# EAGLE schematic TC4Server Test (EAGLE 6.4)
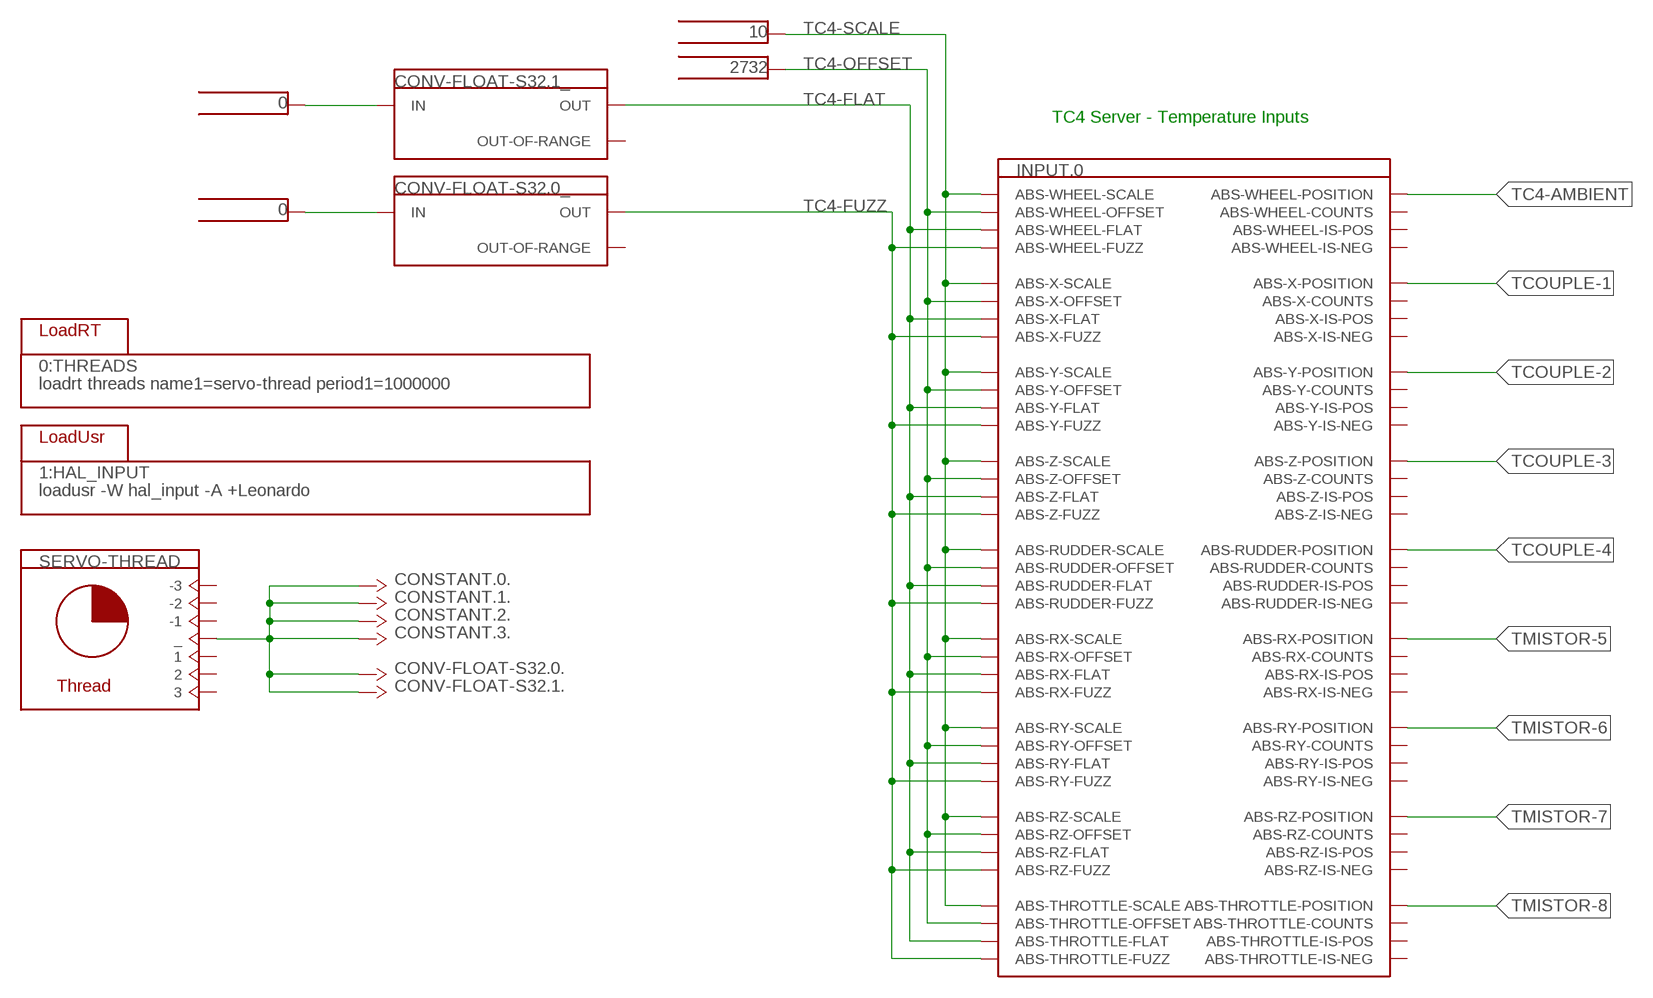
[diagram p0: schematic, sheet 1]

## Parts
0:THREADS  loadrt threads name1=servo-thread period1=1000000  LOADRT  [DUMMY]
CONSTANT.0  10  CONSTANT  [DUMMY]
CONSTANT.1  2732  CONSTANT  [DUMMY]
CONSTANT.2  0  CONSTANT  [DUMMY]
CONSTANT.3  0  CONSTANT  [DUMMY]
CONV-FLOAT-S32.0  CONV_FLOAT_S32  [DUMMY]
CONV-FLOAT-S32.1  CONV_FLOAT_S32  [DUMMY]
INPUT.0  JOYSTICK  [DUMMY]
SERVO-THREAD  THREAD  [DUMMY]

## Nets
N$1: CONSTANT.0.P$1 CONSTANT.1.P$1 CONSTANT.2.P$1 CONSTANT.3.P$1 CONV-FLOAT-S32.0.P$1(.:PIN_THREAD) CONV-FLOAT-S32.1.P$1(.:PIN_THREAD) SERVO-THREAD.P$7(_)
N$2: CONSTANT.2.P$2 CONV-FLOAT-S32.1.P$3(_:IN)
N$3: CONSTANT.3.P$2 CONV-FLOAT-S32.0.P$3(_:IN)
TC4-AMBIENT: INPUT.0.P$47(ABS-WHEEL-POSITION)
TC4-FLAT: CONV-FLOAT-S32.1.P$4(_:OUT) INPUT.0.P$2(ABS-RUDDER-FLAT) INPUT.0.P$10(ABS-RX-FLAT) INPUT.0.P$18(ABS-RY-FLAT) INPUT.0.P$26(ABS-RZ-FLAT) INPUT.0.P$34(ABS-THROTTLE-FLAT) INPUT.0.P$42(ABS-WHEEL-FLAT) INPUT.0.P$50(ABS-X-FLAT) INPUT.0.P$58(ABS-Y-FLAT) INPUT.0.P$66(ABS-Z-FLAT)
TC4-FUZZ: CONV-FLOAT-S32.0.P$4(_:OUT) INPUT.0.P$3(ABS-RUDDER-FUZZ) INPUT.0.P$11(ABS-RX-FUZZ) INPUT.0.P$19(ABS-RY-FUZZ) INPUT.0.P$27(ABS-RZ-FUZZ) INPUT.0.P$35(ABS-THROTTLE-FUZZ) INPUT.0.P$43(ABS-WHEEL-FUZZ) INPUT.0.P$51(ABS-X-FUZZ) INPUT.0.P$59(ABS-Y-FUZZ) INPUT.0.P$67(ABS-Z-FUZZ)
TC4-OFFSET: CONSTANT.1.P$2 INPUT.0.P$6(ABS-RUDDER-OFFSET) INPUT.0.P$14(ABS-RX-OFFSET) INPUT.0.P$22(ABS-RY-OFFSET) INPUT.0.P$30(ABS-RZ-OFFSET) INPUT.0.P$38(ABS-THROTTLE-OFFSET) INPUT.0.P$46(ABS-WHEEL-OFFSET) INPUT.0.P$54(ABS-X-OFFSET) INPUT.0.P$62(ABS-Y-OFFSET) INPUT.0.P$70(ABS-Z-OFFSET)
TC4-SCALE: CONSTANT.0.P$2 INPUT.0.P$8(ABS-RUDDER-SCALE) INPUT.0.P$16(ABS-RX-SCALE) INPUT.0.P$24(ABS-RY-SCALE) INPUT.0.P$32(ABS-RZ-SCALE) INPUT.0.P$40(ABS-THROTTLE-SCALE) INPUT.0.P$48(ABS-WHEEL-SCALE) INPUT.0.P$56(ABS-X-SCALE) INPUT.0.P$64(ABS-Y-SCALE) INPUT.0.P$72(ABS-Z-SCALE)
TCOUPLE-1: INPUT.0.P$55(ABS-X-POSITION)
TCOUPLE-2: INPUT.0.P$63(ABS-Y-POSITION)
TCOUPLE-3: INPUT.0.P$71(ABS-Z-POSITION)
TCOUPLE-4: INPUT.0.P$7(ABS-RUDDER-POSITION)
TMISTOR-5: INPUT.0.P$15(ABS-RX-POSITION)
TMISTOR-6: INPUT.0.P$23(ABS-RY-POSITION)
TMISTOR-7: INPUT.0.P$31(ABS-RZ-POSITION)
TMISTOR-8: INPUT.0.P$39(ABS-THROTTLE-POSITION)
Unconnected: CONV-FLOAT-S32.0.P$2(.CLAMP:PIN_PARAMETER) CONV-FLOAT-S32.0.P$5(_:OUT-OF-RANGE) CONV-FLOAT-S32.1.P$2(.CLAMP:PIN_PARAMETER) CONV-FLOAT-S32.1.P$5(_:OUT-OF-RANGE) INPUT.0.P$1(ABS-RUDDER-COUNTS) INPUT.0.P$4(ABS-RUDDER-IS-NEG) INPUT.0.P$5(ABS-RUDDER-IS-POS) INPUT.0.P$9(ABS-RX-COUNTS) INPUT.0.P$12(ABS-RX-IS-NEG) INPUT.0.P$13(ABS-RX-IS-POS) INPUT.0.P$17(ABS-RY-COUNTS) INPUT.0.P$20(ABS-RY-IS-NEG) INPUT.0.P$21(ABS-RY-IS-POS) INPUT.0.P$25(ABS-RZ-COUNTS) INPUT.0.P$28(ABS-RZ-IS-NEG) INPUT.0.P$29(ABS-RZ-IS-POS) INPUT.0.P$33(ABS-THROTTLE-COUNTS) INPUT.0.P$36(ABS-THROTTLE-IS-NEG) INPUT.0.P$37(ABS-THROTTLE-IS-POS) INPUT.0.P$41(ABS-WHEEL-COUNTS) INPUT.0.P$44(ABS-WHEEL-IS-NEG) INPUT.0.P$45(ABS-WHEEL-IS-POS) INPUT.0.P$49(ABS-X-COUNTS) INPUT.0.P$52(ABS-X-IS-NEG) INPUT.0.P$53(ABS-X-IS-POS) INPUT.0.P$57(ABS-Y-COUNTS) INPUT.0.P$60(ABS-Y-IS-NEG) INPUT.0.P$61(ABS-Y-IS-POS) INPUT.0.P$65(ABS-Z-COUNTS) INPUT.0.P$68(ABS-Z-IS-NEG) INPUT.0.P$69(ABS-Z-IS-POS) SERVO-THREAD.P$1(-1) SERVO-THREAD.P$2(-2) SERVO-THREAD.P$3(-3) SERVO-THREAD.P$4 SERVO-THREAD.P$5 SERVO-THREAD.P$6

## Notes on the sheet
- TC4 Server - Temperature Inputs

## Library data of the parts
0:THREADS = hal-config:LOADRT: HAL LoadRT Loads realtime module Part Name field = <index>:MODULEn Set <index> to control load sequence MODULEn triggers Eagle-to-HAL script Part Value field = HAL module command line: loadrt threads name1=test-thread period1=1000000
CONSTANT.0 CONSTANT.1-CONSTANT.3 = hal-config:CONSTANT: Emit constant value Rename first device: constant.1 -> constant.0
CONV-FLOAT-S32.0 CONV-FLOAT-S32.1 = hal-config:CONV_FLOAT_S32: CONV_FLOAT_S32 NAME conv_float_s32 − Convert a value from float to s32 SYNOPSIS loadrt conv_float_s32 [count=N|names=name1[,name2...]] FUNCTIONS conv-float-s32.N (requires a floating-point thread) Update ’out’ based on ’in’ PINS conv-float-s32.N.in float in conv-float-s32.N.out s32 out conv-float-s32.N.out-of-range bit out TRUE when ’in’ is not in the range of s32 PARAMETERS conv-float-s32.N.clamp bit rw If TRUE, then clamp to the range of s32. If FALSE, then allow the value to "wrap around". LICENSE GPL
INPUT.0 = hal-config:JOYSTICK: Joystick HAL Joystick Controller
SERVO-THREAD = hal-config:THREAD